# Altium schematic sheet Sheet1.SchDoc
size A4
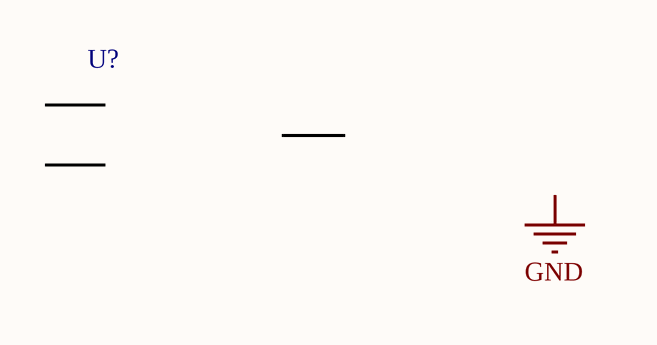
[diagram p0: Sheet1.SchDoc]

## Parts
U?  Digital OR Gate  (value not drawn)

## Nets

Not connected (* = marked no-connect by the designer): U? 1 2 3

## Notes on the sheet
- Labels drawn without touching a wire or pin: GND

## Library data of the parts
U? = Digital OR: rise_delay_inst: 1n; input_load_inst: 1p; adc_in_low_inst: 9; adc_in_high_inst: 1; dac_out_low_inst: 0; dac_out_undef_inst: 0.5; SimulationGenericComponent: True; fall_delay_inst: 1n; adc_rise_delay_inst: 1n; adc_fall_delay_inst: 1n; dac_out_high_inst: 1; dac_input_load_inst: 1p; dac_t_rise_inst: 1n; dac_t_fall_inst: 1n